# EAGLE design Beta24_mt (EAGLE 9.4.2)
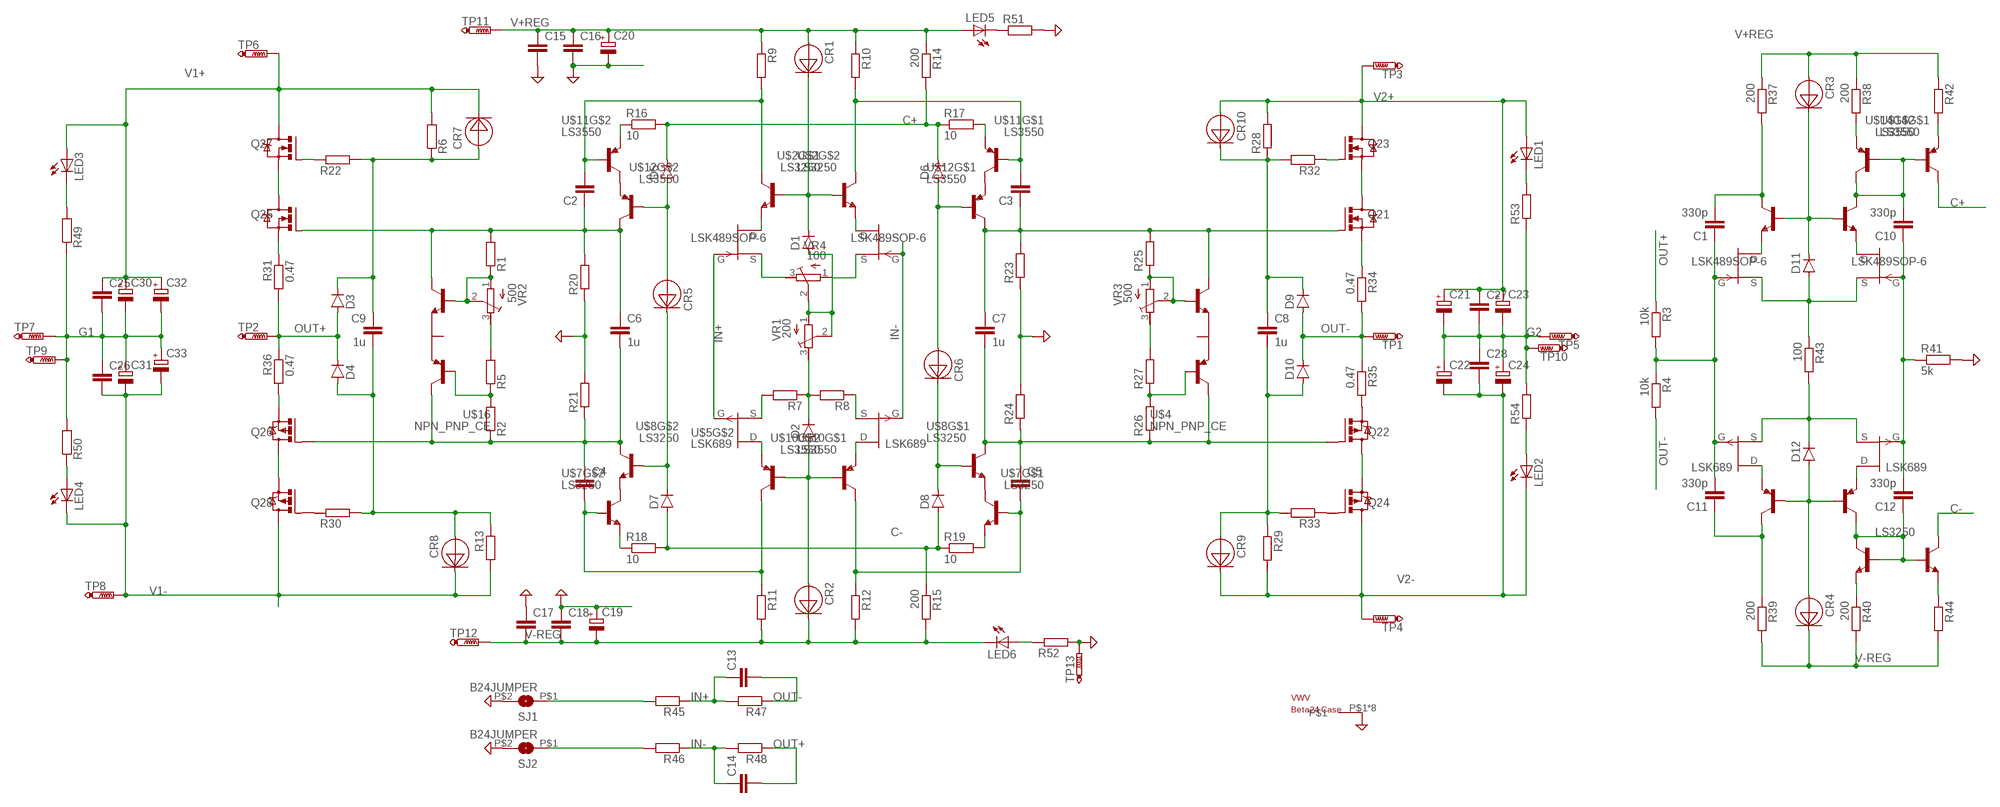
[diagram p0: schematic, sheet 1]

## Parts
C1  330p  C-EUC1206  [C1206]
C2  C-EUC1206  [C1206]
C3  C-EUC1206  [C1206]
C4  C-EUC1206  [C1206]
C5  C-EUC1206  [C1206]
C6  1u  C-EUC1210  [C1210]
C7  1u  C-EUC1210  [C1210]
C8  1u  C-EUC1206  [C1206]
C9  1u  C-EUC1206  [C1206]
C10  330p  C-EUC1206  [C1206]
C11  330p  C-EUC1206  [C1206]
C12  330p  C-EUC1206  [C1206]
C13  C-EUC1206  [C1206]
C14  C-EUC1206  [C1206]
C15  C-EUC1206  [C1206]
C16  C-EUC1206  [C1206]
C17  C-EUC1206  [C1206]
C18  C-EUC1206  [C1206]
C19  CPOL-EUG  [PANASONIC_G]
C20  CPOL-EUG  [PANASONIC_G]
C21  CPOL-EUG  [PANASONIC_G]
C22  CPOL-EUG  [PANASONIC_G]
C23  CPOL-EUG  [PANASONIC_G]
C24  CPOL-EUG  [PANASONIC_G]
C25  C-EUC1206  [C1206]
C26  C-EUC1206  [C1206]
C27  C-EUC1206  [C1206]
C28  C-EUC1206  [C1206]
C30  CPOL-EUG  [PANASONIC_G]
C31  CPOL-EUG  [PANASONIC_G]
C32  CPOL-EUG  [PANASONIC_G]
C33  CPOL-EUG  [PANASONIC_G]
CR1  1N5283  [SMD]
CR2  1N5283  [SMD]
CR3  1N5283  [SMD]
CR4  1N5283  [SMD]
CR5  1N5283  [SMD]
CR6  1N5283  [SMD]
CR7  1N5283  [SMD]
CR8  1N5283  [SMD]
CR9  1N5283  [SMD]
CR10  1N5283  [SMD]
D1  DIODE-SOD80C  [SOD80C]
D2  DIODE-SOD80C  [SOD80C]
D3  DIODE-SOD80C  [SOD80C]
D4  DIODE-SOD80C  [SOD80C]
D5  DIODE-SOD80C  [SOD80C]
D6  DIODE-SOD80C  [SOD80C]
D7  DIODE-SOD80C  [SOD80C]
D8  DIODE-SOD80C  [SOD80C]
D9  DIODE-SOD80C  [SOD80C]
D10  DIODE-SOD80C  [SOD80C]
D11  DIODE-SOD80C  [SOD80C]
D12  DIODE-SOD80C  [SOD80C]
LED1  LED_LEDSML1206  [LED_SML1206]
LED2  LED_LEDSML1206  [LED_SML1206]
LED3  LED_LEDSML1206  [LED_SML1206]
LED4  LED_LEDSML1206  [LED_SML1206]
LED5  LED_LEDSML1206  [LED_SML1206]
LED6  LED_LEDSML1206  [LED_SML1206]
Q21  IRFZ24ND2PAK  [TO254P1054X240-3M]
Q22  IRF9Z34D2PAK  [TO254P1054X240-3M]
Q23  IRFZ24ND2PAK  [TO254P1054X240-3M]
Q24  IRF9Z34D2PAK  [TO254P1054X240-3M]
Q25  IRFZ24ND2PAK  [TO254P1054X240-3M]
Q26  IRF9Z34D2PAK  [TO254P1054X240-3M]
Q27  IRFZ24ND2PAK  [TO254P1054X240-3M]
Q28  IRF9Z34D2PAK  [TO254P1054X240-3M]
R1  R-EU_MELF0204W  [MINI_MELF-0204W]
R2  R-EU_MELF0204W  [MINI_MELF-0204W]
R3  10k  R-EU_MELF0204W  [MINI_MELF-0204W]
R4  10k  R-EU_MELF0204W  [MINI_MELF-0204W]
R5  R-EU_MELF0204W  [MINI_MELF-0204W]
R6  R-EU_MELF0204W  [MINI_MELF-0204W]
R7  R-EU_MELF0204W  [MINI_MELF-0204W]
R8  R-EU_MELF0204W  [MINI_MELF-0204W]
R9  R-EU_MELF0204W  [MINI_MELF-0204W]
R10  R-EU_MELF0204W  [MINI_MELF-0204W]
R11  R-EU_MELF0204W  [MINI_MELF-0204W]
R12  R-EU_MELF0204W  [MINI_MELF-0204W]
R13  R-EU_MELF0204W  [MINI_MELF-0204W]
R14  200  R-EU_MELF0204W  [MINI_MELF-0204W]
R15  200  R-EU_MELF0204W  [MINI_MELF-0204W]
R16  10  R-EU_MELF0204W  [MINI_MELF-0204W]
R17  10  R-EU_MELF0204W  [MINI_MELF-0204W]
R18  10  R-EU_MELF0204W  [MINI_MELF-0204W]
R19  10  R-EU_MELF0204W  [MINI_MELF-0204W]
R20  R-EU_MELF0204W  [MINI_MELF-0204W]
R21  R-EU_MELF0204W  [MINI_MELF-0204W]
R22  R-EU_MELF0204W  [MINI_MELF-0204W]
R23  R-EU_MELF0204W  [MINI_MELF-0204W]
R24  R-EU_MELF0204W  [MINI_MELF-0204W]
R25  R-EU_MELF0204W  [MINI_MELF-0204W]
R26  R-EU_MELF0204W  [MINI_MELF-0204W]
R27  R-EU_MELF0204W  [MINI_MELF-0204W]
R28  R-EU_MELF0204W  [MINI_MELF-0204W]
R29  R-EU_MELF0204W  [MINI_MELF-0204W]
R30  R-EU_MELF0204W  [MINI_MELF-0204W]
R31  0.47  R-EU_R2512  [R2512]
R32  R-EU_MELF0204W  [MINI_MELF-0204W]
R33  R-EU_MELF0204W  [MINI_MELF-0204W]
R34  0.47  R-EU_R2512  [R2512]
R35  0.47  R-EU_R2512  [R2512]
R36  0.47  R-EU_R2512  [R2512]
R37  200  R-EU_MELF0204W  [MINI_MELF-0204W]
R38  200  R-EU_MELF0204W  [MINI_MELF-0204W]
R39  200  R-EU_MELF0204W  [MINI_MELF-0204W]
R40  200  R-EU_MELF0204W  [MINI_MELF-0204W]
R41  5k  R-EU_MELF0204W  [MINI_MELF-0204W]
R42  R-EU_MELF0204W  [MINI_MELF-0204W]
R43  100  R-EU_MELF0204W  [MINI_MELF-0204W]
R44  R-EU_MELF0204W  [MINI_MELF-0204W]
R45  R-EU_MELF0204W  [MINI_MELF-0204W]
R46  R-EU_MELF0204W  [MINI_MELF-0204W]
R47  R-EU_MELF0204W  [MINI_MELF-0204W]
R48  R-EU_MELF0204W  [MINI_MELF-0204W]
R49  R-EU_MELF0204W  [MINI_MELF-0204W]
R50  R-EU_MELF0204W  [MINI_MELF-0204W]
R51  200  R-EU_MELF0204W  [MINI_MELF-0204W]
R52  R-EU_MELF0204W  [MINI_MELF-0204W]
R53  R-EU_MELF0204W  [MINI_MELF-0204W]
R54  R-EU_MELF0204W  [MINI_MELF-0204W]
SJ1  B24JUMPER  [B24J]
SJ2  B24JUMPER  [B24J]
TP1  PTR1PAD1-20  [P1-20]
TP2  PTR1PAD1-20  [P1-20]
TP3  PTR1PAD1-20  [P1-20]
TP4  PTR1PAD1-20  [P1-20]
TP5  PTR1PAD1-20  [P1-20]
TP6  PTR1PAD1-20  [P1-20]
TP7  PTR1PAD1-20  [P1-20]
TP8  PTR1PAD1-20  [P1-20]
TP9  PTR1PAD1-20  [P1-20]
TP10  PTR1PAD1-20  [P1-20]
TP11  PTR1PAD1-20  [P1-20]
TP12  PTR1PAD1-20  [P1-20]
TP13  PTR1PAD1-20  [P1-20]
U$1  LSK489SOP-6  [SOT-23-6]
U$2  LS3250  [SOT-23-6]
U$3  LSK489SOP-6  [SOT-23-6]
U$4  NPN_PNP_CE  [SOT25]
U$5  LSK689  [SOT-23-6]
U$6  LS3250  [SOT-23-6]
U$7  LS3250  [SOT-23-6]
U$8  LS3250  [SOT-23-6]
U$9  LS3550  [SOT-23-6]
U$10  LS3550  [SOT-23-6]
U$11  LS3550  [SOT-23-6]
U$12  LS3550  [SOT-23-6]
U$13  LS3250  [SOT-23-6]
U$14  LS3550  [SOT-23-6]
U$15  LSK689  [SOT-23-6]
U$16  NPN_PNP_CE  [SOT25]
U$17  VWV  [VWV]
U$18  B24C  [B24C]
VR1  200  R-TRIMM3296W  [RTRIM3296W]
VR2  500  R-TRIMM3296W  [RTRIM3296W]
VR3  500  R-TRIMM3296W  [RTRIM3296W]
VR4  100  R-TRIMM3296W  [RTRIM3296W]

## Nets
C+: D5.C D6.C R14.2 R16.2 R17.1 U$14.6(C)
C-: D7.A D8.A R15.1 R18.2 R19.1 U$13.6(C)
G1: C25.2 C26.1 C30.- C31.+ C32.- C33.+ R49.1 R50.2 TP7.TP TP9.TP
G2: C21.- C22.+ C23.- C24.+ C27.2 C28.1 R53.1 R54.2 TP5.TP TP10.TP
GND: C15.2 C16.2 C17.1 C18.1 C19.+ C20.- R20.1 R21.2 R23.1 R24.2 R41.2 R51.2 R52.2 SJ1.P$2 SJ2.P$2 TP13.TP U$18.P$1 U$18.P$2 U$18.P$3 U$18.P$4 U$18.P$5 U$18.P$6 U$18.P$7 U$18.P$8
IN+: C13.1 R45.1 R47.2 U$1.1(G) U$5.4(G)
IN-: C14.1 R46.1 R48.2 U$1.4(G) U$5.1(G)
N$1: C12.1 U$9.6(C) U$13.1(B) U$13.3(B) U$13.4(C)
N$2: U$1.5(D) U$2.2(E)
N$3: U$1.3(S) VR4.3(E)
N$4: R7.2 U$5.6(S)
N$5: U$1.2(D) U$2.5(E)
N$6: U$5.5(D) U$10.2(E)
N$7: U$1.6(S) VR4.1(A)
N$8: D2.C R7.1 R8.2 VR1.3(E)
N$9: R8.1 U$5.3(S)
N$10: U$5.2(D) U$10.5(E)
N$11: D1.A VR1.1(A) VR1.2(S) VR4.2(S)
N$12: CR2.ANODE D2.A U$10.1(B) U$10.3(B)
N$13: C2.2 R9.2 U$2.6(C) U$11.3(B)
N$14: C3.2 R10.2 U$2.4(C) U$11.1(B)
N$15: C3.1 C7.1 Q21.1(G) R23.2 R25.2 U$4.5(C1) U$12.6(C)
N$16: CR1.CATHODE D1.C U$2.1(B) U$2.3(B)
N$17: R40.1 U$13.2(E)
N$18: C5.2 R12.1 U$7.1(B) U$10.6(C)
N$19: C1.1 C11.2 R3.2 R4.1 U$3.1(G) U$15.4(G)
N$20: C8.2 CR9.ANODE D10.A R29.1 R33.2
N$21: D12.C R43.2 U$15.3(S) U$15.6(S)
N$22: D11.A R43.1 U$3.3(S) U$3.6(S)
N$23: U$11.6(C) U$12.5(E)
N$24: C4.2 R11.1 U$7.3(B) U$10.4(C)
N$25: U$11.4(C) U$12.2(E)
N$26: R38.2 U$14.2(E)
N$27: R16.1 U$11.2(E)
N$28: R17.2 U$11.5(E)
N$29: C10.2 U$6.4(C) U$14.1(B) U$14.3(B) U$14.4(C)
N$30: R18.1 U$7.2(E)
N$31: R19.2 U$7.5(E)
N$32: R45.2 SJ1.P$1
N$33: U$3.5(D) U$6.2(E)
N$34: CR4.ANODE D12.A U$9.1(B) U$9.3(B)
N$35: C2.1 C6.1 Q25.1(G) R1.2 R20.2 U$12.4(C) U$16.5(C1)
N$36: C4.1 C6.2 Q26.1(G) R2.1 R21.1 U$8.4(C) U$16.4(C2)
N$37: U$7.6(C) U$8.5(E)
N$38: U$7.4(C) U$8.2(E)
N$39: R25.1 U$4.1(B1) VR3.1(A) VR3.2(S)
N$42: C1.2 R37.2 U$6.6(C)
N$43: CR5.ANODE D5.A U$12.3(B)
N$44: CR6.ANODE D6.A U$12.1(B)
N$45: CR5.CATHODE D7.C U$8.3(B)
N$46: CR6.CATHODE D8.C U$8.1(B)
N$47: R26.2 R27.1 U$4.3(B2)
N$48: R27.2 VR3.3(E)
N$50: C5.1 C7.2 Q22.1(G) R24.1 R26.1 U$4.4(C2) U$8.6(C)
N$51: R2.2 R5.1 U$16.3(B2)
N$53: R44.1 U$13.5(E)
N$54: C8.1 CR10.CATHODE D9.C R28.1 R32.2
N$57: Q21.2(D) Q21.4(D) Q21.P$1(D) Q21.P$2(D) Q21.P$3(D) Q21.P$4(D) Q21.P$5(D) Q21.P$6(D) Q21.P$7(D) Q21.P$8(D) Q21.P$9(D) Q21.P$10(D) Q21.P$11(D) Q21.P$12(D) Q21.P$13(D) Q21.P$14(D) Q21.P$15(D) Q21.P$16(D) Q21.P$17(D) Q21.P$18(D) Q21.P$19(D) Q21.P$20(D) Q21.P$21(D) Q21.P$22(D) Q21.P$23(D) Q21.P$24(D) Q21.P$25(D) Q21.P$26(D) Q21.P$27(D) Q21.P$28(D) Q21.P$29(D) Q21.P$30(D) Q21.P$31(D) Q21.P$32(D) Q21.P$33(D) Q21.P$34(D) Q21.P$35(D) Q21.P$36(D) Q21.P$37(D) Q21.P$38(D) Q21.P$39(D) Q21.P$40(D) Q21.P$41(D) Q21.P$42(D) Q21.P$43(D) Q21.P$44(D) Q21.P$45(D) Q21.P$46(D) Q21.P$47(D) Q21.P$48(D) Q21.P$49(D) Q21.P$50(D) Q21.P$51(D) Q21.P$52(D) Q21.P$53(D) Q21.P$54(D) Q21.P$55(D) Q21.P$56(D) Q21.P$57(D) Q21.P$58(D) Q21.P$59(D) Q21.P$60(D) Q21.P$61(D) Q21.P$62(D) Q21.P$63(D) Q23.3(S)
N$58: Q22.2(D) Q22.4(D) Q22.P$1(D) Q22.P$2(D) Q22.P$3(D) Q22.P$4(D) Q22.P$5(D) Q22.P$6(D) Q22.P$7(D) Q22.P$8(D) Q22.P$9(D) Q22.P$10(D) Q22.P$11(D) Q22.P$12(D) Q22.P$13(D) Q22.P$14(D) Q22.P$15(D) Q22.P$16(D) Q22.P$17(D) Q22.P$18(D) Q22.P$19(D) Q22.P$20(D) Q22.P$21(D) Q22.P$22(D) Q22.P$23(D) Q22.P$24(D) Q22.P$25(D) Q22.P$26(D) Q22.P$27(D) Q22.P$28(D) Q22.P$29(D) Q22.P$30(D) Q22.P$31(D) Q22.P$32(D) Q22.P$33(D) Q22.P$34(D) Q22.P$35(D) Q22.P$36(D) Q22.P$37(D) Q22.P$38(D) Q22.P$39(D) Q22.P$40(D) Q22.P$41(D) Q22.P$42(D) Q22.P$43(D) Q22.P$44(D) Q22.P$45(D) Q22.P$46(D) Q22.P$47(D) Q22.P$48(D) Q22.P$49(D) Q22.P$50(D) Q22.P$51(D) Q22.P$52(D) Q22.P$53(D) Q22.P$54(D) Q22.P$55(D) Q22.P$56(D) Q22.P$57(D) Q22.P$58(D) Q22.P$59(D) Q22.P$60(D) Q22.P$61(D) Q22.P$62(D) Q22.P$63(D) Q24.3(S)
N$59: Q23.1(G) R32.1
N$60: Q24.1(G) R33.1
N$61: C9.1 CR7.ANODE D3.C R6.1 R22.2
N$62: Q21.3(S) R34.1
N$63: Q22.3(S) R35.2
N$64: C9.2 CR8.ANODE D4.A R13.1 R30.2
N$65: Q25.2(D) Q25.4(D) Q25.P$1(D) Q25.P$2(D) Q25.P$3(D) Q25.P$4(D) Q25.P$5(D) Q25.P$6(D) Q25.P$7(D) Q25.P$8(D) Q25.P$9(D) Q25.P$10(D) Q25.P$11(D) Q25.P$12(D) Q25.P$13(D) Q25.P$14(D) Q25.P$15(D) Q25.P$16(D) Q25.P$17(D) Q25.P$18(D) Q25.P$19(D) Q25.P$20(D) Q25.P$21(D) Q25.P$22(D) Q25.P$23(D) Q25.P$24(D) Q25.P$25(D) Q25.P$26(D) Q25.P$27(D) Q25.P$28(D) Q25.P$29(D) Q25.P$30(D) Q25.P$31(D) Q25.P$32(D) Q25.P$33(D) Q25.P$34(D) Q25.P$35(D) Q25.P$36(D) Q25.P$37(D) Q25.P$38(D) Q25.P$39(D) Q25.P$40(D) Q25.P$41(D) Q25.P$42(D) Q25.P$43(D) Q25.P$44(D) Q25.P$45(D) Q25.P$46(D) Q25.P$47(D) Q25.P$48(D) Q25.P$49(D) Q25.P$50(D) Q25.P$51(D) Q25.P$52(D) Q25.P$53(D) Q25.P$54(D) Q25.P$55(D) Q25.P$56(D) Q25.P$57(D) Q25.P$58(D) Q25.P$59(D) Q25.P$60(D) Q25.P$61(D) Q25.P$62(D) Q25.P$63(D) Q27.3(S)
N$66: Q26.2(D) Q26.4(D) Q26.P$1(D) Q26.P$2(D) Q26.P$3(D) Q26.P$4(D) Q26.P$5(D) Q26.P$6(D) Q26.P$7(D) Q26.P$8(D) Q26.P$9(D) Q26.P$10(D) Q26.P$11(D) Q26.P$12(D) Q26.P$13(D) Q26.P$14(D) Q26.P$15(D) Q26.P$16(D) Q26.P$17(D) Q26.P$18(D) Q26.P$19(D) Q26.P$20(D) Q26.P$21(D) Q26.P$22(D) Q26.P$23(D) Q26.P$24(D) Q26.P$25(D) Q26.P$26(D) Q26.P$27(D) Q26.P$28(D) Q26.P$29(D) Q26.P$30(D) Q26.P$31(D) Q26.P$32(D) Q26.P$33(D) Q26.P$34(D) Q26.P$35(D) Q26.P$36(D) Q26.P$37(D) Q26.P$38(D) Q26.P$39(D) Q26.P$40(D) Q26.P$41(D) Q26.P$42(D) Q26.P$43(D) Q26.P$44(D) Q26.P$45(D) Q26.P$46(D) Q26.P$47(D) Q26.P$48(D) Q26.P$49(D) Q26.P$50(D) Q26.P$51(D) Q26.P$52(D) Q26.P$53(D) Q26.P$54(D) Q26.P$55(D) Q26.P$56(D) Q26.P$57(D) Q26.P$58(D) Q26.P$59(D) Q26.P$60(D) Q26.P$61(D) Q26.P$62(D) Q26.P$63(D) Q28.3(S)
N$67: Q27.1(G) R22.1
N$68: Q28.1(G) R30.1
N$69: Q26.3(S) R36.2
N$70: Q25.3(S) R31.1
N$71: R1.1 U$16.1(B1) VR2.1(A) VR2.2(S)
N$72: R5.2 VR2.3(E)
N$73: CR3.CATHODE D11.C U$6.1(B) U$6.3(B)
N$75: U$3.2(D) U$6.5(E)
N$76: C10.1 C12.2 R41.1 U$3.4(G) U$15.1(G)
N$77: U$9.2(E) U$15.5(D)
N$79: U$9.5(E) U$15.2(D)
N$80: C11.1 R39.1 U$9.4(C)
N$81: R42.2 U$14.5(E)
N$82: R46.2 SJ2.P$1
N$89: LED3.C R49.2
N$90: LED4.A R50.1
N$91: LED5.C R51.1
N$92: LED6.A R52.1
N$93: LED2.A R54.1
N$94: LED1.C R53.2
OUT+: C14.2 D3.A D4.C R3.1 R31.2 R36.1 R48.1 TP2.TP
OUT-: C13.2 D9.A D10.C R4.2 R34.2 R35.1 R47.1 TP1.TP
V1+: C25.1 C30.+ C32.+ CR7.CATHODE LED3.A Q27.2(D) Q27.4(D) Q27.P$1(D) Q27.P$2(D) Q27.P$3(D) Q27.P$4(D) Q27.P$5(D) Q27.P$6(D) Q27.P$7(D) Q27.P$8(D) Q27.P$9(D) Q27.P$10(D) Q27.P$11(D) Q27.P$12(D) Q27.P$13(D) Q27.P$14(D) Q27.P$15(D) Q27.P$16(D) Q27.P$17(D) Q27.P$18(D) Q27.P$19(D) Q27.P$20(D) Q27.P$21(D) Q27.P$22(D) Q27.P$23(D) Q27.P$24(D) Q27.P$25(D) Q27.P$26(D) Q27.P$27(D) Q27.P$28(D) Q27.P$29(D) Q27.P$30(D) Q27.P$31(D) Q27.P$32(D) Q27.P$33(D) Q27.P$34(D) Q27.P$35(D) Q27.P$36(D) Q27.P$37(D) Q27.P$38(D) Q27.P$39(D) Q27.P$40(D) Q27.P$41(D) Q27.P$42(D) Q27.P$43(D) Q27.P$44(D) Q27.P$45(D) Q27.P$46(D) Q27.P$47(D) Q27.P$48(D) Q27.P$49(D) Q27.P$50(D) Q27.P$51(D) Q27.P$52(D) Q27.P$53(D) Q27.P$54(D) Q27.P$55(D) Q27.P$56(D) Q27.P$57(D) Q27.P$58(D) Q27.P$59(D) Q27.P$60(D) Q27.P$61(D) Q27.P$62(D) Q27.P$63(D) R6.2 TP6.TP
V1-: C26.2 C31.- C33.- CR8.CATHODE LED4.C Q28.2(D) Q28.4(D) Q28.P$1(D) Q28.P$2(D) Q28.P$3(D) Q28.P$4(D) Q28.P$5(D) Q28.P$6(D) Q28.P$7(D) Q28.P$8(D) Q28.P$9(D) Q28.P$10(D) Q28.P$11(D) Q28.P$12(D) Q28.P$13(D) Q28.P$14(D) Q28.P$15(D) Q28.P$16(D) Q28.P$17(D) Q28.P$18(D) Q28.P$19(D) Q28.P$20(D) Q28.P$21(D) Q28.P$22(D) Q28.P$23(D) Q28.P$24(D) Q28.P$25(D) Q28.P$26(D) Q28.P$27(D) Q28.P$28(D) Q28.P$29(D) Q28.P$30(D) Q28.P$31(D) Q28.P$32(D) Q28.P$33(D) Q28.P$34(D) Q28.P$35(D) Q28.P$36(D) Q28.P$37(D) Q28.P$38(D) Q28.P$39(D) Q28.P$40(D) Q28.P$41(D) Q28.P$42(D) Q28.P$43(D) Q28.P$44(D) Q28.P$45(D) Q28.P$46(D) Q28.P$47(D) Q28.P$48(D) Q28.P$49(D) Q28.P$50(D) Q28.P$51(D) Q28.P$52(D) Q28.P$53(D) Q28.P$54(D) Q28.P$55(D) Q28.P$56(D) Q28.P$57(D) Q28.P$58(D) Q28.P$59(D) Q28.P$60(D) Q28.P$61(D) Q28.P$62(D) Q28.P$63(D) R13.2 TP8.TP
V2+: C21.+ C23.+ C27.1 CR10.ANODE LED1.A Q23.2(D) Q23.4(D) Q23.P$1(D) Q23.P$2(D) Q23.P$3(D) Q23.P$4(D) Q23.P$5(D) Q23.P$6(D) Q23.P$7(D) Q23.P$8(D) Q23.P$9(D) Q23.P$10(D) Q23.P$11(D) Q23.P$12(D) Q23.P$13(D) Q23.P$14(D) Q23.P$15(D) Q23.P$16(D) Q23.P$17(D) Q23.P$18(D) Q23.P$19(D) Q23.P$20(D) Q23.P$21(D) Q23.P$22(D) Q23.P$23(D) Q23.P$24(D) Q23.P$25(D) Q23.P$26(D) Q23.P$27(D) Q23.P$28(D) Q23.P$29(D) Q23.P$30(D) Q23.P$31(D) Q23.P$32(D) Q23.P$33(D) Q23.P$34(D) Q23.P$35(D) Q23.P$36(D) Q23.P$37(D) Q23.P$38(D) Q23.P$39(D) Q23.P$40(D) Q23.P$41(D) Q23.P$42(D) Q23.P$43(D) Q23.P$44(D) Q23.P$45(D) Q23.P$46(D) Q23.P$47(D) Q23.P$48(D) Q23.P$49(D) Q23.P$50(D) Q23.P$51(D) Q23.P$52(D) Q23.P$53(D) Q23.P$54(D) Q23.P$55(D) Q23.P$56(D) Q23.P$57(D) Q23.P$58(D) Q23.P$59(D) Q23.P$60(D) Q23.P$61(D) Q23.P$62(D) Q23.P$63(D) R28.2 TP3.TP
V2-: C22.- C24.- C28.2 CR9.CATHODE LED2.C Q24.2(D) Q24.4(D) Q24.P$1(D) Q24.P$2(D) Q24.P$3(D) Q24.P$4(D) Q24.P$5(D) Q24.P$6(D) Q24.P$7(D) Q24.P$8(D) Q24.P$9(D) Q24.P$10(D) Q24.P$11(D) Q24.P$12(D) Q24.P$13(D) Q24.P$14(D) Q24.P$15(D) Q24.P$16(D) Q24.P$17(D) Q24.P$18(D) Q24.P$19(D) Q24.P$20(D) Q24.P$21(D) Q24.P$22(D) Q24.P$23(D) Q24.P$24(D) Q24.P$25(D) Q24.P$26(D) Q24.P$27(D) Q24.P$28(D) Q24.P$29(D) Q24.P$30(D) Q24.P$31(D) Q24.P$32(D) Q24.P$33(D) Q24.P$34(D) Q24.P$35(D) Q24.P$36(D) Q24.P$37(D) Q24.P$38(D) Q24.P$39(D) Q24.P$40(D) Q24.P$41(D) Q24.P$42(D) Q24.P$43(D) Q24.P$44(D) Q24.P$45(D) Q24.P$46(D) Q24.P$47(D) Q24.P$48(D) Q24.P$49(D) Q24.P$50(D) Q24.P$51(D) Q24.P$52(D) Q24.P$53(D) Q24.P$54(D) Q24.P$55(D) Q24.P$56(D) Q24.P$57(D) Q24.P$58(D) Q24.P$59(D) Q24.P$60(D) Q24.P$61(D) Q24.P$62(D) Q24.P$63(D) R29.2 TP4.TP
V+REG: C15.1 C16.1 C20.+ CR1.ANODE CR3.ANODE LED5.A R9.1 R10.1 R14.1 R37.1 R38.1 R42.1 TP11.TP
V-REG: C17.2 C18.2 C19.- CR2.CATHODE CR4.CATHODE LED6.C R11.2 R12.2 R15.2 R39.2 R40.2 R44.2 TP12.TP
Unconnected: U$4.2(E) U$16.2(E)

## Library data of the parts
C1-C18 C25-C28 = Vwvwbg:C-EU: CAPACITOR, European symbol
C19-C24 C30-C33 = Vwvwbg:CPOL-EU: POLARIZED CAPACITOR, European symbol
CR1-CR10 = crd:1N5283: 0.22 mA through 4.23 mA current regulating diode series
D1-D12 = Vwvwbg:DIODE-: DIODE
LED1-LED6 = KGGR_M:LED_LED: LED OSRAM: - CHIPLED LG R971, LG N971, LY N971, LG Q971, LY Q971, LO R971, LY R971 LH N974, LH R974 LS Q976, LO Q976, LY Q976 LO Q996 - Hyper CHIPLED LW Q18S LB Q993, LB Q99A, LB R99A - SideLED LS A670, LO A670, LY A670, LG A670, LP A670 LB A673, LV A673, LT A673, LW A673 LH A674 LY A675 LS A676, LA A676, LO A676, LY A676, LW A676 LS A679, LY A679, LG A679 - Hyper Micro SIDELED® LS Y876, LA Y876, LO Y876, LY Y876 LT Y87S - SmartLED LW L88C, LW L88S LB L89C, LB L89S, LG L890 LS L89K, LO L89K, LY L89K LS L896, LA L896, LO L896, LY L896 - TOPLED LS T670, LO T670, LY T670, LG T670, LP T670 LSG T670, LSP T670, LSY T670, LOP T670, LYG T670 LG T671, LOG T671, LSG T671 LB T673, LV T673, LT T673, LW T673 LH T674 LS T676, LA T676, LO T676, LY T676, LB T676, LH T676, LSB T676, LW T676 LB T67C, LV T67C, LT T67C, LS T67K, LO T67K, LY T67K, LW E67C LS E67B, LA E67B, LO E67B, LY E67B, LB E67C, LV E67C, LT E67C LW T67C LS T679, LY T679, LG T679 LS T770, LO T770, LY T770, LG T770, LP T770 LB T773, LV T773, LT T773, LW T773 LH T774 LS E675, LA E675, LY E675, LS T675 LS T776, LA T776, LO T776, LY T776, LB T776 LHGB T686 LT T68C, LB T68C - Hyper Mini TOPLED® LB M676 - Mini TOPLED Santana® LG M470 LS M47K, LO M47K, LY M47K Source: http://www.osram.convergy.de LUXEON: - LUMILED® LXK2-PW12-R00, LXK2-PW12-S00, LXK2-PW14-U00, LXK2-PW14-V00 LXK2-PM12-R00, LXK2-PM12-S00, LXK2-PM14-U00 LXK2-PE12-Q00, LXK2-PE12-R00, LXK2-PE12-S00, LXK2-PE14-T00, LXK2-PE14-U00 LXK2-PB12-K00, LXK2-PB12-L00, LXK2-PB12-M00, LXK2-PB14-N00, LXK2-PB14-P00, LXK2-PB14-Q00 LXK2-PR12-L00, LXK2-PR12-M00, LXK2-PR14-Q00, LXK2-PR14-R00 LXK2-PD12-Q00, LXK2-PD12-R00, LXK2-PD12-S00 LXK2-PH12-R00, LXK2-PH12-S00 LXK2-PL12-P00, LXK2-PL12-Q00, LXK2-PL12-R00 Source: www.luxeon.com KINGBRIGHT: KA-3528ASYC Source: www.kingbright.com
Q21 Q23 Q25 Q27 = Vwvwbg:IRFZ24N
Q22 Q24 Q26 Q28 = Vwvwbg:IRF9Z34
R1-R54 = Vwvwbg:R-EU_: RESISTOR, European symbol
SJ1 SJ2 = Vwvwbg:B24JUMPER
TP1-TP13 = testpad:PTR1: TEST PIN
U$1 U$3 = Vwvwbg:LSK489
U$2 U$6-U$8 U$13 = Vwvwbg:LS3250
U$4 U$16 = Vwvwbg:NPN_PNP_CE
U$5 U$15 = Vwvwbg:LSK689
U$9-U$12 U$14 = Vwvwbg:LS3550
U$17 = Vwvwbg:VWV
U$18 = Vwvwbg:B24C
VR1-VR4 = Vwvwbg:R-TRIMM: Trimm resistor; SPICEMODEL: X; SPICEPREFIXL: POT

## Board
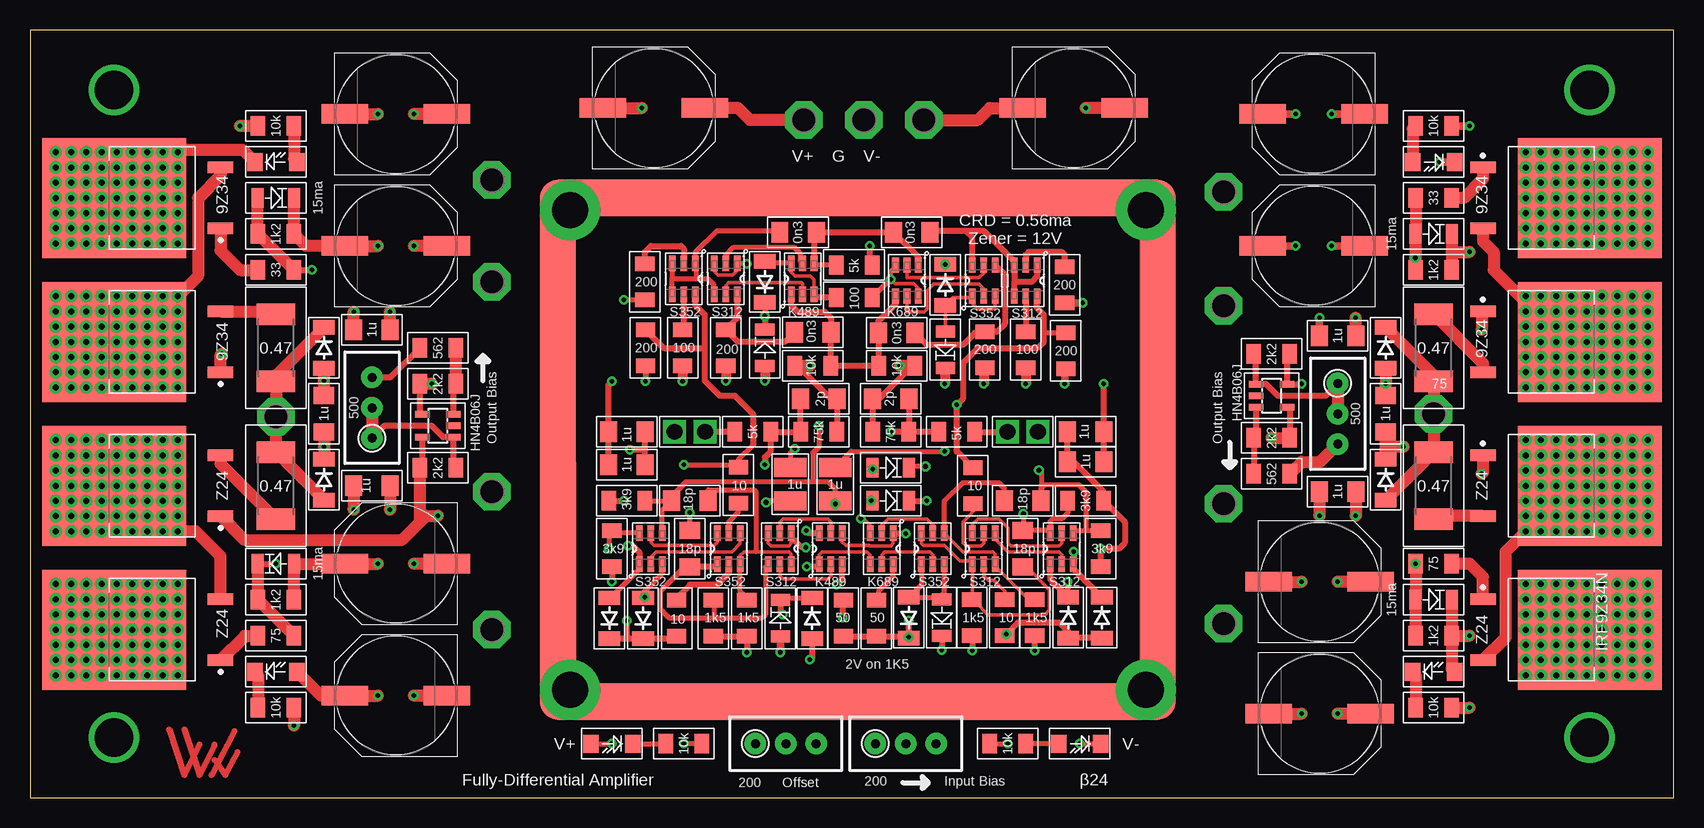
[diagram p1: board, top side]
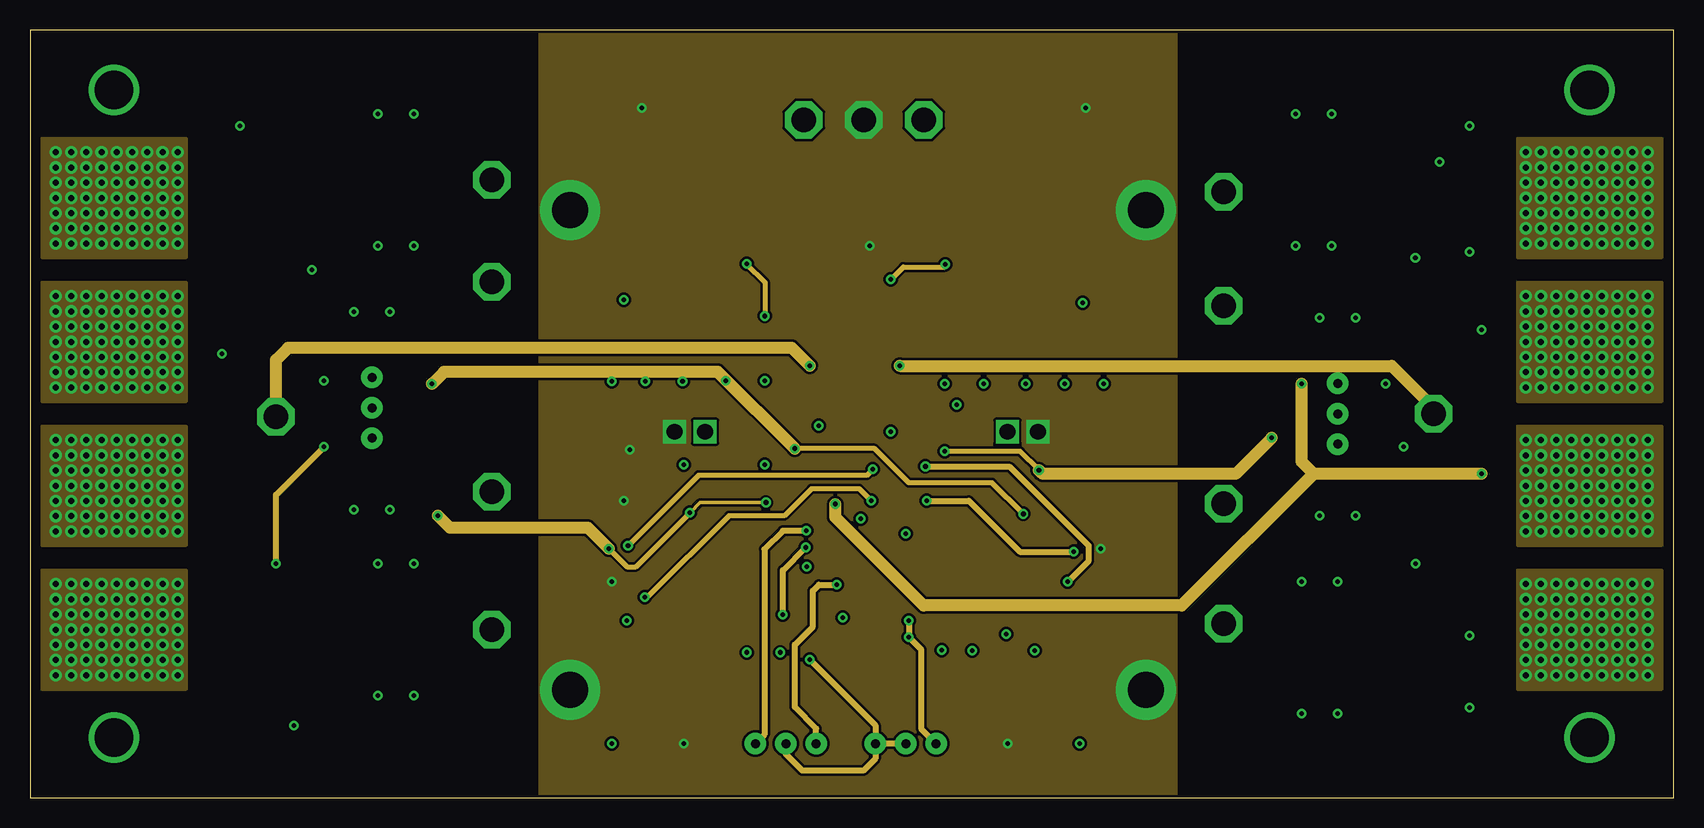
[diagram p2: board, inner layer Route2]
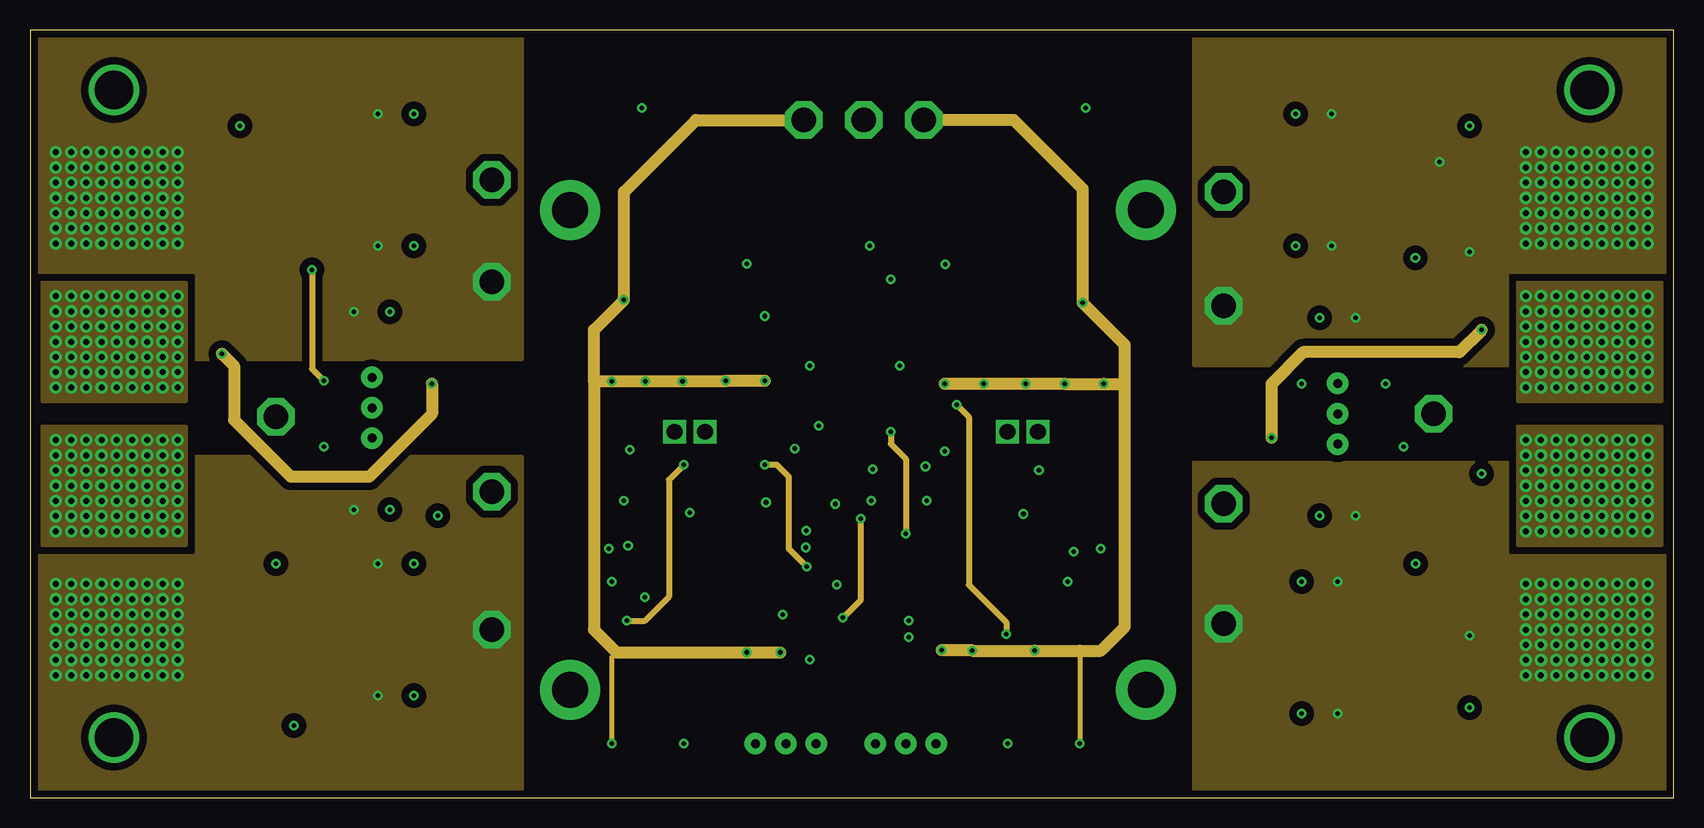
[diagram p3: board, inner layer Route15]
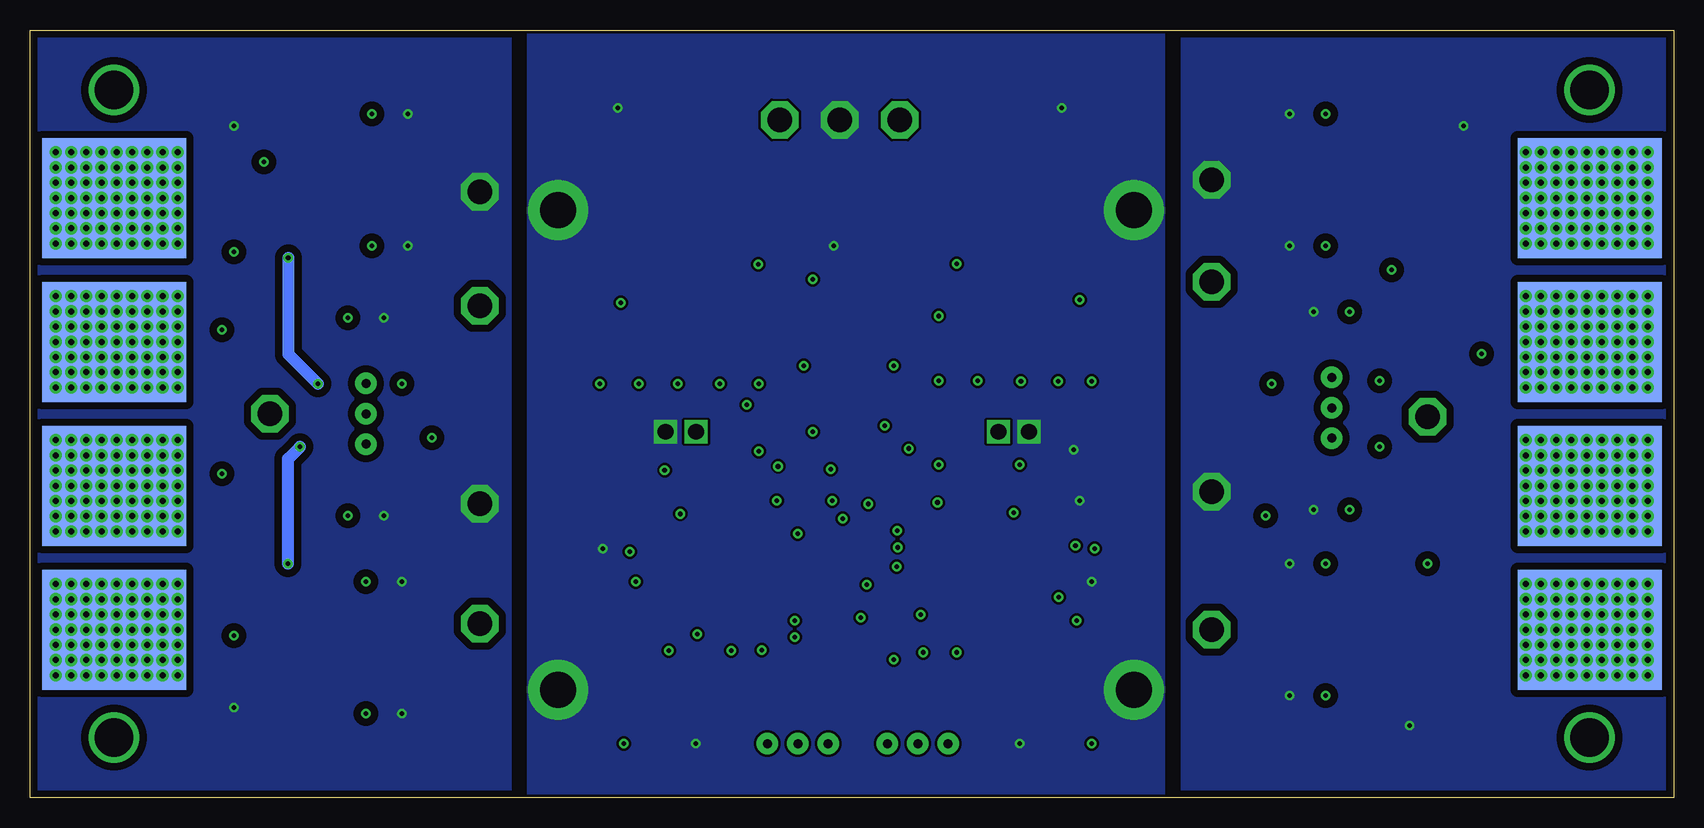
[diagram p4: board, bottom side, seen from below]

Size 137 x 64 mm. Coordinates in mm from the lower left corner, seen from the top.
Outline: 0,0 137,0 137,64 0,64 0,0
Copper layers (1+2*15+16): Top 0.035mm / dielectric 1.5mm / Route2 0.035mm / dielectric 0.15mm / Route15 0.035mm / dielectric 0.2mm / Bottom 0.035mm
Design rules "default *": minimum track width 10mil, minimum drill 0.4mm, track to track 8mil, track to pad 8mil, pad to pad 8mil, via to via 8mil, smd to smd 8mil, copper to edge 10mil, drill to drill 10mil, minimum pad ring 10mil, minimum via ring 8mil, stop-mask expansion 4mil, vias tented up to drill 0.4mm, thermal gap 15mil

### Footprints (pad centres in the part's own frame; a part is rotated, then mirrored left to right if it is on the bottom)
C1206 = smd 1.4 x 1.7: 1 -1.527,0; 2 1.527,0
C1210 = smd 1.6 x 2.7: 1 -1.4,0; 2 1.4,0
PANASONIC_G = smd 3.9 x 1.6: + 4.25,0; - -4.25,0
SMD = smd 1 x 1.6: ANODE 1.525,0; CATHODE -1.525,0
SOD80C = smd 1.2 x 1.8: A 1.7,0; C -1.7,0
LED_SML1206 = smd 1.3 x 1.5: A 1.75,0; C -1.75,0
TO254P1054X240-3M = smd 2.108 x 0.925: 1 -8.887,2.54; 3 -8.887,-2.54 | smd 12 x 10 bottom: 2 0,0 | smd 12 x 10: 4 0,0 | drill 0.5 pad 1.016: P$1 -4.045,2.54; P$2 -2.775,2.54; P$3 -1.505,2.54; P$4 -0.235,2.54; P$5 1.035,2.54; P$6 2.305,2.54; P$7 3.575,2.54; P$8 3.575,1.27; P$9 2.305,1.27; P$10 -0.235,1.27; P$11 1.035,1.27; P$12 -1.505,1.27; P$13 -2.775,1.27; P$14 -4.045,1.27; P$15 -4.045,0; P$16 -2.775,0; P$17 -1.505,0; P$18 -0.235,0; P$19 1.035,0; P$20 2.305,0; P$21 3.575,0; P$22 3.575,-1.27; P$23 2.305,-1.27; P$24 1.035,-1.27; P$25 -0.235,-1.27; P$26 -1.505,-1.27; P$27 -2.775,-1.27; P$28 -4.045,-1.27; P$29 -4.045,-2.54; P$30 -2.775,-2.54; P$31 -1.505,-2.54; P$32 -0.235,-2.54; P$33 1.035,-2.54; P$34 2.305,-2.54; P$35 3.575,-2.54; P$36 3.575,-3.81; P$37 2.305,-3.81; P$38 1.035,-3.81; P$39 -0.235,-3.81; P$40 -2.775,-3.81; P$41 -4.045,-3.81; P$42 -1.505,-3.81; P$43 -4.045,3.81; P$44 -2.775,3.81; P$45 -1.505,3.81; P$46 -0.235,3.81; P$47 1.035,3.81; P$48 2.305,3.81; P$49 3.575,3.81; P$50 4.845,3.81; P$51 4.845,2.54; P$52 4.845,1.27; P$53 4.845,0; P$54 4.845,-1.27; P$55 4.845,-2.54; P$56 4.845,-3.81; P$57 -5.315,3.81; P$58 -5.315,2.54; P$59 -5.315,1.27; P$60 -5.315,0; P$61 -5.315,-1.27; P$62 -5.315,-2.54; P$63 -5.315,-3.81
MINI_MELF-0204W = smd 1.2 x 1.6: 1 -1.5,0; 2 1.5,0
R2512 = smd 1.8 x 3.2: 1 -2.8,0; 2 2.8,0
B24J = drill 1.3 square: P$1 -1.27,0; P$2 1.27,0
P1-20 = drill 2.007 pad 3.15 octagon: TP 0,0
SOT-23-6 = smd 1.27 x 0.559: 1 -1.295,0.95; 2 -1.295,0; 3 -1.295,-0.95; 4 1.295,-0.95; 5 1.295,0; 6 1.295,0.95
SOT25 = smd 0.55 x 1.2: 1 -0.95,-1.3; 2 0,-1.3; 3 0.95,-1.3; 4 0.95,1.3; 5 -0.95,1.3
B24C = drill 3 pad 5: P$1 -24,20; P$2 24,20; P$3 24,-20; P$4 -24,-20 | smd 53 x 3: P$5 0,21; P$6 0,-21 | smd 3 x 45: P$7 -25,0; P$8 25,0
RTRIM3296W = drill 0.75 pad 1.778: 1 0,-2.54; 2 0,0; 3 0,2.54

### Placement (x,y rotation side)
C1  65.25,38.8 180 top
C2  55,24.75 0 top
C3  55,20.75 270 top
C4  82.75,24.75 180 top
C5  82.75,20.75 270 top
C6  67.12,26.12 90 top
C7  63.38,26.12 90 top
C8  24.5,32 90 top
C9  113,32 90 top
C10  64.03,47.12 180 top
C11  72.25,38.75 180 top
C12  73.5,47.12 180 top
C13  65.75,33.25 0 top
C14  71.75,33.25 180 top
C15  49.75,27.75 0 top
C16  49.75,30.5 0 top
C17  88,28 0 top
C18  88,30.5 0 top
C19  87,57.5 0 top
C20  52,57.5 0 top
C21  30.5,8.5 180 top
C22  30.5,57 0 top
C23  30.5,19.5 180 top
C24  30.5,46 0 top
C25  109,25.5 180 top
C26  109,38.5 0 top
C27  28.5,26 0 top
C28  28.5,39 180 top
C30  107.5,7 0 top
C31  107,46 180 top
C32  107.5,18 0 top
C33  107,57 180 top
CR1  62.55,14.95 270 top
CR2  76,15 90 top
CR3  61.25,37.5 270 top
CR4  76.3,37.35 90 top
CR5  71.75,24.75 180 top
CR6  71.75,27.5 180 top
CR7  117,16.5 180 top
CR8  117,47 180 top
CR9  20.5,50 180 top
CR10  20.5,19.5 0 top
D1  65.2,14.95 270 top
D2  73.25,15 90 top
D3  113,26.5 270 top
D4  113,37.5 270 top
D5  51.1,14.95 90 top
D6  48.3,14.95 90 top
D7  89.35,15 270 top
D8  86.55,15 270 top
D9  24.5,26.5 270 top
D10  24.5,37.5 270 top
D11  61.25,43 90 top
D12  76.3,42.75 270 top
LED1  20.5,10.5 0 top
LED2  20.5,53 0 top
LED3  117,10.5 0 top
LED4  117,53 180 top
LED5  48.5,4.5 180 top
LED6  87.5,4.5 180 top
Q21  7,26 180 top
Q22  7,38 180 top
Q23  7,14 180 top
Q24  7,50 180 top
Q25  130,26 0 top
Q26  130,38 0 top
Q27  130,14 0 top
Q28  130,50 0 top
R1  103.5,37 0 top
R2  103.5,30 180 top
R3  72.25,36 180 top
R4  65.25,36 180 top
R5  103.5,27 0 top
R6  117,13.5 0 top
R7  70.55,14.95 90 top
R8  67.8,14.95 270 top
R9  59.75,14.95 90 top
R10  56.95,14.95 90 top
R11  83.75,15 270 top
R12  78.5,15 270 top
R13  117,44 0 top
R14  51.3,37.5 90 top
R15  86.35,37.25 270 top
R16  53.9,14.95 270 top
R17  59.05,26.05 270 top
R18  81.25,15 270 top
R19  78.6,26 270 top
R20  49.75,24.75 0 top
R21  89.25,20.75 270 top
R22  117,19.5 180 top
R23  48.5,20.75 90 top
R24  88,24.75 0 top
R25  34,27.5 180 top
R26  34,34.5 0 top
R27  34,37.5 180 top
R28  20.5,16.5 0 top
R29  20.5,47 0 top
R30  117,50 180 top
R31  117,26 90 top
R32  20.5,13.5 0 top
R33  20.5,44 0 top
R34  20.5,26 90 top
R35  20.5,37.5 90 top
R36  117,37.5 90 top
R37  58,37.5 90 top
R38  51.25,43 90 top
R39  79.6,37.35 270 top
R40  86.25,42.75 270 top
R41  68.7,44.4 0 top
R42  54.4,37.5 90 top
R43  68.7,41.7 0 top
R44  83,37.35 270 top
R45  60.25,30.5 180 top
R46  77.25,30.5 0 top
R47  65.75,30.5 180 top
R48  71.75,30.5 0 top
R49  117,7.5 180 top
R50  117,56 0 top
R51  54.5,4.5 0 top
R52  81.5,4.5 180 top
R53  20.5,7.5 180 top
R54  20.5,56 180 top
SJ1  55,30.5 180 top
SJ2  82.75,30.5 0 top
TP1  20.5,31.75 0 top
TP2  117,32 0 top
TP3  38.5,14 0 top
TP4  38.5,43 0 top
TP5  38.5,25.5 0 top
TP6  99.5,14.5 0 top
TP7  99.5,24.5 0 top
TP8  99.5,41 0 top
TP9  99.5,50.5 0 top
TP10  38.5,51.5 0 top
TP11  64.5,56.5 0 top
TP12  74.5,56.5 0 top
TP13  69.5,56.5 0 top
U$1  66.75,20.75 90 top
U$2  62.5,20.75 270 top
U$3  64.4,43.25 90 top
U$4  34,31 90 top
U$5  71,20.75 270 top
U$6  58,43.25 270 top
U$7  79.5,20.75 90 top
U$8  86,20.75 90 top
U$9  79.5,43.1 90 top
U$10  75.25,20.75 90 top
U$11  58.25,20.75 90 top
U$12  51.75,20.75 90 top
U$13  83,43.1 270 top
U$14  54.5,43.25 270 top
U$15  73.1,43.1 270 top
U$16  103.5,33.5 270 top
U$17  14.12,1.88 0 top
U$18  69,29 0 top
VR1  73,4.5 270 top
VR2  109,32 180 top
VR3  28.5,32.5 0 top
VR4  63,4.5 270 top

### Tracks (layer width: path | path; a pad name or v marks a point on that pad's centre or on a via)
C+  (via drill 0.4)
  Top 0.406: 60.25,29.38 59.05,28.18 R17.1 58.85,27.75 v54.5,27.75
  Top 0.508: U$14.6 55.45,41.05 56.25,40.25 56.25,37.5 | R16.2 53.7,13.25 D5.C 50,13.25 | 50,13.25 D6.C | 60.25,29.38 60.25,32 58.75,33.5 57.5,33.5 56.25,34.75 56.25,37.5 | R14.2 52.8,37.5 56.25,37.5 | 50,13.25 49.75,13.5 v49.75,14.75
  Route15 0.508: v49.75,14.75 51.25,14.75 53.25,16.75 53.25,26.5 v54.5,27.75
C-  (via drill 0.4)
  Top 0.406: R15.1 84.5,38.75
  Top 0.508: D7.A D8.A 86.55,13.8 85.75,14.6 82.35,14.6 v81.38,13.62 R18.2 | R19.1 77.25,28.85 v77.25,32.75 77.75,33.25 77.75,36.25 79,37.5 84,37.5 84.5,38 84.5,38.75 84.5,40.25 83.95,40.8 U$13.6
  Route15 0.508: v77.25,32.75 78.25,31.75 78.25,17.75 81.38,14.62 v81.38,13.62
G1  (via drill 0.4)
  Top 0.61: C26.1 107.47,39.97 v107.5,40 | C31.+ v105.5,46 | C33.+ v105.5,57 | R50.2 v120,56
  Top 1.016: C32.- v106,18 | C25.2 107.47,23.53 v107.5,23.5 | R49.1 v120,7.5 | C30.- v106,7
  pour Bottom (isolate 0.61, rank 2, no thermals): 97,70 97,-4 140,-4 140,70
G2  (via drill 0.4)
  Top 1.016: C23.- v32,19.5 | C21.- v32,8.5 | C27.2 30.03,24.03 v30,24 | C28.1 30,39.03 v30,40.5 | C22.+ v32,57 | C24.+ v32,46 | R54.2 v17.5,56 | R53.1 v22,6
  pour Bottom (isolate 0.61, rank 2, no thermals): -4.5,71 41,71 41,-4 -4.5,-4
GND  (via drill 0.4)
  Top 0.406: R52.2 v81.5,4.5 | R51.2 v54.5,4.5
  Top 0.508: R23.1 v48.5,18 | R20.1 v49.5,24.75 | R21.2 v89.25,20.75 90.75,20.75 91.25,21.25 91.25,23 R24.2 89.5,25.5 87,28 C17.1 C18.1 | C15.2 51.28,29 | 51.28,29 C16.2 | 51.28,29 v50,29 | R41.2 70,44.6 v70,46
  Top 1.016: U$18.P$5 45.5,50 45,50.5 U$18.P$1 | C19.+ v88,57.5 | C20.- v51,57.5 | U$18.P$8 94,9.5 93,8.5 | 93,8.5 U$18.P$3 | U$18.P$7 45,28 U$18.P$4 | U$18.P$6 92.5,8 93,8.5
  pour Route2 (no thermals): 42.5,65.62 95.5,65.62 95.5,-3 42.5,-3
  pour Bottom (no thermals): 42.5,65.62 95.5,65.62 95.5,-3 42.5,-3
IN+  (via drill 0.4)
  Top 0.305: U$5.4 70,19.5 70,20.25 69.75,20.5 66,20.5 65.75,20.25 65.75,19.5 U$1.1
  Top 0.508: C13.1 64.22,30.53 R47.2 R45.1 61.75,28.88 61.25,28.38 v61.25,27.75 | U$1.1 65.59,19.25 v64.75,19.25
  Route15 0.508: v64.75,19.25 63.25,20.75 63.25,26.75 62.25,27.75 v61.25,27.75
IN-  (via drill 0.4)
  Top 0.305: U$5.1 71.95,21.2 71.75,21 69.97,21 69.96,21.01 68,21.01 67.7,21.31 U$1.4
  Top 0.508: C14.1 73.28,30.53 | 73.28,30.53 R48.2 | R46.1 73.3,30.5 | 73.3,30.5 73.28,30.53 | 73.3,30.5 v71.75,30.5 | v73,22 72,22 U$5.1
  Route15 0.508: v71.75,30.5 71.75,29.5 73,28.25 v73,22
N$1
  Top 0.508: U$13.4 82.05,43 | 78.03,47.25 79.5,47.25 82.05,44.7 U$13.3 82.05,43 | U$13.1 83.95,43.45 83.5,43 82.05,43 | U$9.6 78.55,46.73 78.03,47.25 | 78.03,47.25 75.15,47.25 C12.1
N$2
  Top 0.305: U$1.5 66.75,23 66.5,23.25 62.75,23.25 62.5,23 U$2.2
N$3  (via drill 0.4)
  Top 0.508: v67.25,17.75 67.7,18.2 U$1.3
  Route2 0.508: VR4.3 65.54,5.75 63.75,7.54 63.75,12.75 65.25,14.25 65.25,17.25 65.75,17.75 v67.25,17.75
N$4
  Top 0.406: R7.2 70.75,16.65 70.75,17.25 71.95,18.45 U$5.6
N$5
  Top 0.305: U$2.5 62.5,18.5 62.75,18.25 66.5,18.25 66.75,18.5 U$1.2
N$6
  Top 0.305: U$10.2 75.25,20.25 75,20.5 71.97,20.5 71.96,20.49 71.24,20.49 71,20.25 U$5.5
N$7  (via drill 0.4)
  Top 0.508: v64.7,22.25 64.91,22.05 U$1.6
  Route2 0.508: VR4.1 61.21,5.25 61.21,20.71 62.75,22.25 v64.7,22.25
N$8  (via drill 0.4)
  Top 0.508: R8.2 R7.1 73.1,13.45 D2.C v73.25,13.38 v73.25,14.75
  Route2 0.508: v73.25,14.75 v73.25,13.38 74.29,12.34 74.29,5.75 VR1.3
N$9  (via drill 0.4)
  Top 0.305: U$5.3 70.05,22.7 69.5,23.25 v69.25,23.25
  Top 0.508: v67.75,15 67.75,16.4 R8.1
  Route15 0.508: v67.75,15 69.25,16.5 v69.25,23.25
N$10
  Top 0.305: U$5.2 71,22.75 71.5,23.25 74.75,23.25 75.25,22.75 U$10.5
N$11  (via drill 0.4)
  Top 0.508: D1.A 65.2,11.7 v65,11.5
  Route2 0.508: v65,11.5 70.46,6.04 VR1.1 | VR1.2 VR1.1 | VR1.1 70.46,3.25 69.46,2.25 64.38,2.25 63,3.62 VR4.2
N$12
  Top 0.406: U$10.1 74.3,17.75 D2.A 75.83,16.7 | 75.83,16.7 CR2.ANODE | U$10.3 76.2,17.07 75.83,16.7
N$13
  Top 0.305: U$2.6 63.45,20.3 63.26,20.49 60.76,20.49 60.75,20.5 60.5,20.5 59.5,20.5 59.2,20.2 U$11.3
  Top 0.406: R9.2 59.75,16.65 59.2,17.2 U$11.3 | C2.2 56.53,25.65 60.35,25.65 60.5,25.5 60.5,20.5
N$14
  Top 0.406: C3.2 54.55,19.22 52.55,17.22 52.55,15.7 53.25,15 57,15 | U$2.4 61.3,19.2 61.3,15.25 61.05,15 57,15 | R10.2 57,16.4 57,15
  Top 0.508: U$11.1 57.07,19.22 C3.2
N$15  (via drill 0.4)
  Top 0.406: U$12.6 48.7,22.05 R23.2 48.25,22 v48.25,20.75 | C3.1 v55,23.75 | C7.1 61.48,24.73 v61.35,24.6
  Top 0.508: U$4.5 32.7,27.7 R25.2
  Top 1.016: Q21.1 17.85,21.5 31,21.5 32.5,23 | 32.5,23 R25.2 | 32.5,23 33,23.5 v34,23.5
  Route2 0.305: v61.35,24.6 55.85,24.6 v55,23.75
  Route2 0.406: v48.25,20.75 49.75,19.25 50.5,19.25 v55,23.75
  Route2 1.016: v34,23.5 35,22.5 46.5,22.5 v48.25,20.75
N$16  (via drill 0.4)
  Top 0.305: U$2.1 63.45,21.75 63.45,21.2 63.25,21 61.75,21 61.5,21.25 61.5,22 U$2.3
  Top 0.406: CR1.CATHODE 62.73,16.65 D1.C
  Top 0.508: v62.75,15.25 62.55,15.45 CR1.CATHODE | v64.66,20.86 64.34,20.86 63.45,21.75
  Route2 0.508: v62.75,15.25 62.75,18.95 v64.66,20.86
N$17
  Top 0.508: R40.1 86.25,45.25 86,45.5 83.25,45.5 83,45.25 U$13.2
N$18
  Top 0.305: U$10.6 74.3,21.2 74.49,21.01 76.24,21.01 77.5,19.75 78.25,19.75 U$7.1 78.55,16.8 78.4,16.65 78.4,16.4 R12.1 78.7,16.3 78.8,16.3 79.85,15.25 84.6,15.25 84.99,15.64 84.99,17.33 83.1,19.22 C5.2
N$19
  Top 0.508: U$3.1 63.45,41.05 64,40.5 66.25,40.5 66.78,39.97 C1.1 66.75,38.77 R4.1 R3.2 70.72,36.03 C11.2 70.72,39.72 72.15,41.15 U$15.4
N$20  (via drill 0.4)
  Top 0.508: R33.2 v23.5,44
  Top 1.016: CR9.ANODE 18.98,47.02 R29.1 R33.2 | C8.2 v24.5,34.75 D10.A
  Route15 0.508: v23.5,44 23.5,35.75 v24.5,34.75
N$21  (via drill 0.4)
  Top 0.305: U$15.3 71.75,43.99 v71.75,43.2 72.1,42.85 73.65,42.85 74.05,42.45 U$15.6
  Top 0.406: R43.2 71.7,43.2 v71.75,43.2
  Route2 0.406: v71.75,43.2 72.8,44.25 76.25,44.25 76.3,44.3 D12.C
  other vias: 76.3,44.45
N$22
  Top 0.305: U$3.3 65.35,43.2 65.05,43.5 63.75,43.5 63.45,43.8 U$3.6
  Top 0.406: U$3.6 61.41,44.55 D11.A
  Top 0.508: R43.1 65.61,41.7 U$3.3
N$23
  Top 0.305: U$11.6 57.3,21.3 57.01,21.01 52,21.01 51.75,21.26 U$12.5
N$24
  Top 0.305: R11.1 83.25,16.5 80.45,19.3 U$7.3 80.45,20.3 80.25,20.5 79.47,20.5 79.46,20.49 77.76,20.49 U$10.4
  Top 0.406: C4.2 81.22,25.78 80.75,26.25 77.75,26.25 76.2,24.7 U$10.4
N$25
  Top 0.305: U$11.4 59.2,21.2 58.5,20.5 52.2,20.5 51.75,20.05 U$12.2
N$26
  Top 0.508: R38.2 51.25,45.5 51.75,46 54.25,46 54.5,45.75 U$14.2
N$27
  Top 0.508: U$11.2 58.25,18.75 57.25,17.75 55,17.75 53.9,16.65 R16.1
N$28
  Top 0.406: U$11.5 58.25,23 59.05,23.8 R17.2
N$29
  Top 0.406: C10.2 62.37,47.25 57.25,47.25 55.45,45.45 U$14.1 55.5,44.49 55.5,43.25 | U$6.4 57,42.01 57,42.75 56.5,43.25 55.5,43.25 | 53.5,43.25 53.5,44.59 U$14.3 | 55.5,43.25 53.5,43.25 | U$14.4 53.5,42.01 53.5,43.25
N$30
  Top 0.305: U$7.2 79.5,18.5 79.9,18.1 80.35,18.1 81.25,17.2 R18.1
N$31
  Top 0.305: R19.2 79.14,24.39 77.75,23 77.75,21.25 78,21 79.25,21 79.5,21.25 U$7.5
N$32
  Top 0.508: R45.2 SJ1.P$1
N$33
  Top 0.406: U$3.5 64.24,44.71 64.24,45.35 63.74,45.84 58.59,45.84 58,45.25 U$6.2
N$34
  Top 0.305: CR4.ANODE D12.A 76.95,41.7 78.5,41.7 | U$9.1 78.5,41.8 78.5,41.7 | U$9.3 80.45,40.95 80.21,40.71 79.07,40.71 79.04,40.75 79,40.75 78.5,41.25 78.5,41.7
N$35  (via drill 0.4)
  Top 0.406: C2.1 53.47,25.12 54.67,26.32 65.25,26.32 | R20.2 C2.1 | U$12.4 52.7,23.98 C2.1 | v67.12,24.48 67.12,25 67.12,25.75 66.56,26.32 65.25,26.32 | v65.75,31 65.75,29.25 65.25,28.75 65.25,26.32
  Top 0.508: R1.2 104.8,36.8 U$16.5 105.95,34.45 v106,34.5 | C6.1 67.12,25
  Top 1.016: Q25.1 121.11,27.11 v121,27
  Route2 1.016: v121,27 107,27 | 107,27 96.02,16.02 74.48,16.02 67.12,23.38 v67.12,24.48 | 107,27 106,28 v106,34.5
N$36  (via drill 0.4)
  Top 0.406: R21.1 88,22.25 | 88,22.25 87.16,22.25 U$8.4 | 88,22.25 88,25.5 87.4,26.1 84.6,26.1 84.28,25.78 C4.1 84.3,24.77 84.3,27.1 v84.1,27.3 | C6.2 68.47,28.88 v76.25,28.88
  Top 0.508: U$16.4 105,32.35 R2.1
  Top 1.016: Q26.1 121,40.43 v121,39 | v103.5,30 R2.1
  Route2 0.406: v84.1,27.3 82.53,28.88 v76.25,28.88
  Route2 1.016: v103.5,30 100.5,27 84.4,27 v84.1,27.3
  Route15 1.016: v103.5,30 103.5,34.5 106.14,37.14 119.14,37.14 v121,39
N$37
  Top 0.305: U$7.6 78.55,22.8 79,23.25 80.75,23.25 81.5,22.5 81.5,21.25 81.75,21 85.75,21 86,21.25 U$8.5
N$38
  Top 0.305: U$8.2 86,20.25 85.76,20.49 81.51,20.49 80.45,21.55 U$7.4
N$39
  Top 0.508: R25.1 35.3,27.7 U$4.1 34.45,30.05 33.5,31 33.12,31 33.1,30.98 29.52,30.98 VR3.1
  Top 1.016: VR3.2 VR3.1
N$40  (via drill 3.2)
  other vias: 130,5
N$41  (via drill 3.2)
  other vias: 7,5
N$42
  Top 0.508: U$6.6 58.95,39.95 R37.2 59,38 62.92,38 C1.2
N$43  (via drill 0.4)
  Top 0.406: CR5.ANODE v70.12,24.75 | D5.A 51.19,16.65 v51.25,16.71 51.25,17.25 52.7,18.7 U$12.3
  Route2 0.406: v70.12,24.75 69.12,25.75 65.12,25.75 62.88,23.5 58.25,23.5 51.46,16.71 v51.25,16.71
N$44  (via drill 0.4)
  Top 0.406: D6.A 48.4,16.65 50.8,19.05 U$12.1 50.8,19.5 | v70.25,27.38 70.22,27.4 CR6.ANODE
  Top 0.508: v49.85,21 50.25,21 50.8,20.45 50.8,19.5
  Route2 0.406: v49.85,21 55.73,26.88 69.75,26.88 v70.25,27.38
N$45  (via drill 0.4)
  Top 0.508: D7.C 86.95,19.1 U$8.3 87,19.5 v87,20.5 | CR5.CATHODE v74.75,24.75
  Route2 0.508: v74.75,24.75 78.25,24.75 82.5,20.5 v87,20.5
N$46  (via drill 0.4)
  Top 0.406: v74.64,27.61 73.39,27.61 CR6.CATHODE
  Top 0.508: U$8.1 85.05,18.2 D8.C 86.5,16.75 v86.5,18
  Route2 0.406: 74.69,27.56 v74.64,27.61
  Route2 0.508: v86.5,18 88.25,19.75 88.25,21 81.69,27.56 74.69,27.56
N$47
  Top 0.508: U$4.3 35.3,34.3 R26.2
  Top 1.016: R26.2 R27.1
N$48
  Top 0.508: R27.2 30.04,35.04 VR3.3
N$50  (via drill 0.4)
  Top 0.406: R24.1 86.5,23.75 86,23.25 85.25,23.25 85.05,23.05 U$8.6 84.82,22.28 C5.1 82.8,22.33 v82.8,23.65 | C7.2 63.38,28.72 v63.75,29.09
  Top 0.508: U$4.4 32.5,32.15 R26.1
  Top 1.016: Q22.1 15.89,36.89 v16,37 | v33.5,34.5 R26.1
  Route2 0.406: v63.75,29.09 70.41,29.09 73.25,26.25 80.2,26.25 v82.8,23.65
  Route2 1.016: v63.75,29.09 57.34,35.5 34.5,35.5 v33.5,34.5
  Route15 1.016: v16,37 17,36 17,31.5 21.75,26.75 28.25,26.75 33.5,32 v33.5,34.5
N$51
  Top 0.508: U$16.3 102.2,30.2 R2.2 R5.1
N$53
  Top 0.508: U$13.5 R44.1
N$54  (via drill 0.4)
  Top 0.508: CR10.CATHODE v20.5,19.5
  Top 1.016: C8.1 v24.5,29.25 D9.C | CR10.CATHODE 19,19.48 R28.1 R32.2
  Route2 0.508: v20.5,19.5 20.5,25.25 v24.5,29.25
N$57
  Top 0.508: Q21.2 10.81,22.19 13.81,22.19
  Top 1.016: Q23.3 15.89,20.11 13.81,22.19 Q21.P$57
  Bottom 0.508: Q21.2 10.81,22.19 Q21.P$57
  Bottom 1.016: Q21.2 Q21.P$18 | Q21.P$17 9,26.5 7.5,26.5 Q21.2 | Q21.2 7,27.04 Q21.P$25 | Q21.2 8.27,27.27 Q21.P$26 | Q21.2 Q21.P$19
  pour Route2 (no thermals): 1,31 13,31 13,21 1,21
  pour Route15 (no thermals): 1,31 13,31 13,21 1,21
N$58
  Top 0.508: Q22.4 11.5,42.5 13,42.5
  Top 1.016: Q24.3 15.89,51.89 14,50 14,43.49 13,42.5 Q22.P$63
  Bottom 0.508: Q22.4 10.81,41.81 Q22.P$63
  pour Route15 (no thermals): 1,43 13,43 13,33 1,33
  pour Route2 (no thermals): 1,43 13,43 13,33 1,33
N$59
  Top 1.016: Q23.1 17.93,13.5 R32.1
N$60
  Top 1.016: Q24.1 15.89,45.61 17.5,44 R33.1
N$61  (via drill 0.4)
  Top 1.016: R6.1 115.47,13.53 CR7.ANODE 115.5,16.52 R22.2 | D3.C 113,29.5 | 113,29.5 C9.1 | v114.5,29.25 113.25,29.25 113,29.5
  Bottom 1.016: R22.2 115.5,28.25 v114.5,29.25
  other vias: 115.5,19.5
N$62
  Top 1.016: Q21.3 15.89,27.81 R34.1
N$63
  Top 1.016: Q22.3 20.26,40.54 R35.2
N$64  (via drill 0.4)
  Top 1.016: R13.1 115.47,44.02 v115.47,45 CR8.ANODE 115.5,47.02 R30.2 | D4.A v113,34.5 C9.2
  Bottom 1.016: v115.47,45 115.47,36.98 v113,34.5
N$65
  Top 0.508: Q25.2 128.73,27.27 Q25.P$14
  Top 1.016: Q27.3 123,13.35 123,20.5 Q25.P$63
  Bottom 0.508: Q25.2 Q25.P$17 Q25.P$13
  pour Route2 (no thermals): 124,31 136,31 136,21 124,21
  pour Route15 (no thermals): 124,31 136,31 136,21 124,21
N$66
  Top 0.508: Q26.4 128,40 127.5,40 128.04,40.54 Q26.P$3
  Top 1.016: Q28.3 121.11,46.39 122,45.5 122,44 124.19,41.81 Q26.P$57
  Bottom 0.508: Q26.4 127.46,40.54 Q26.P$2
  pour Route2 (no thermals): 124,43 136,43 136,33 124,33
  pour Route15 (no thermals): 124,43 136,43 136,33 124,33
N$67
  Top 1.016: Q27.1 121.11,18.39 120,19.5 R22.1
N$68
  Top 1.016: Q28.1 121.11,51.61 119.5,50 R30.1
N$69
  Top 1.016: R36.2 121.11,36.19 Q26.3
N$70
  Top 1.016: Q25.3 117.26,23.46 R31.1
N$71
  Top 0.508: VR2.1 107.96,33.5 104,33.5 103,34.5 102.25,34.5 U$16.1 102.2,36.8 R1.1
  Top 1.016: VR2.1 VR2.2
N$72
  Top 1.016: R5.2 106,28 107.54,28 VR2.3
N$73  (via drill 0.4)
  Top 0.305: U$6.1 58.95,43.95 58.55,43.55 57.35,43.55 57,43.9 57,44.49
  Top 0.406: U$6.1 59.7,44.55 v59.74,44.5 | U$6.3 57,44.49
  Top 0.508: D11.C v61.25,40.15 CR3.CATHODE
  Route2 0.406: v59.74,44.5 61.25,42.99 v61.25,40.15
N$75
  Top 0.305: U$3.2 64.4,42.85 64.31,42.94 63.98,42.94 63.98,42.95 58.24,42.95 58,42.7 U$6.5
N$76
  Top 0.406: R41.1 65.5,44.4 U$3.4
  Top 0.508: U$3.4 65.35,46.92 C10.1 C12.2 74.05,45.05 U$15.1
N$77
  Top 0.305: U$15.5 73.1,40.5 74.5,40.5 74.75,40.75 74.75,42.25 75.3,42.8 79.1,42.8 79.5,42.4 U$9.2
N$79
  Top 0.305: U$9.5 79.5,43.75 79.11,43.36 73.1,43.36 U$15.2
N$80
  Top 0.508: U$9.4 81.25,43.59 81.25,39.5 80.6,38.85 R39.1 79.5,38.75 78.75,38.75 77.75,37.75 74.78,37.75 C11.1
N$81
  Top 0.406: R42.2 54.4,39.5 54.5,39.6
  Top 0.508: 54.5,39.6 U$14.5
N$82
  Top 0.508: R46.2 SJ2.P$1
N$87  (via drill 3.2)
  other vias: 7,59
N$88  (via drill 3.2)
  other vias: 130,59
N$89
  Top 1.016: LED3.C 115.5,10.25 R49.2
N$90
  Top 1.016: R50.1 115.25,55.75 LED4.A
N$91
  Top 0.406: LED5.C R51.1
N$92
  Top 0.406: LED6.A R52.1
N$93
  Top 1.016: R54.1 22,53.25 LED2.A
N$94
  Top 1.016: LED1.C 19,10.25 R53.2
OUT+  (via drill 0.4)
  Top 0.508: R48.1 70.25,33.22 C14.2 70.75,33.25 73.5,36 R3.1
  Top 1.016: R3.1 v72.5,36 | D3.A R31.2 TP2.TP R36.1 117,35.2 D4.C
  Route2 1.016: v72.5,36 113.5,36 117,32.5 TP2.TP
OUT-  (via drill 0.4)
  Top 0.508: R4.2 64,36 66.75,33.25 C13.2 67.25,33.22 R47.1
  Top 1.016: v65,36 R4.2 | D10.C 20.5,35.2 R35.1 TP1.TP R34.2 D9.A
  Route2 1.016: TP1.TP 20.5,36.5 21.5,37.5 63.5,37.5 v65,36
V1+  (via drill 0.4)
  Top 0.508: Q27.2 Q27.P$17 Q27.P$1
  Top 1.016: CR7.CATHODE 118.53,13.53 R6.2 | R6.2 118.5,10.75 LED3.A | C30.+ v109,7 | C32.+ v109,18 | C25.1 110.53,23.53 v110.5,23.5 | R6.2 v120,13.5
  Bottom 0.508: Q27.2 Q27.P$18 Q27.P$2
  pour Route2 (no thermals): 124,19 136,19 136,9 124,9
  pour Route15 (no thermals): 124,19 136,19 136,9 124,9
  pour Route15 (isolate 0.61, rank 2, no thermals): 97,28 138.5,28 138.5,-4 97,-4
V1-  (via drill 0.4)
  Top 0.508: Q28.4 129.76,50.23 Q28.P$10
  Top 0.61: C33.- v108.5,57 | C31.- v108.5,46 | LED4.C v117.5,53
  Top 1.016: CR8.CATHODE 118.5,46.98 118.5,45.5 | 118.5,45.5 R13.2 | 118.5,45.5 v120,45.5 | C26.2 110.5,38.53 v110.5,40
  Bottom 0.508: Q28.4 Q28.P$17 Q28.P$57
  pour Route2 (no thermals): 124,55 136,55 136,45 124,45
  pour Route15 (no thermals): 124,55 136,55 136,45 124,45
  pour Route15 (isolate 0.61, rank 2, no thermals): 97,65.5 138,65.5 138,36 97,36
V2+  (via drill 0.4)
  Top 0.508: C21.+ 25.5,8.5 | Q23.2 Q23.P$15
  Top 1.016: R28.2 22.02,16.52 CR10.ANODE C23.+ v29,19.5 | v29,8.5 25.5,8.5 24.25,8.5 LED1.A | C27.1 26.97,24.03 v27,24
  Bottom 0.508: Q23.2 10.81,17.81 Q23.P$41
  pour Route2 (no thermals): 1,19 13,19 13,9 1,9
  pour Route15 (no thermals): 1,19 13,19 13,9 1,9
  pour Route15 (isolate 0.61, rank 2, no thermals): 41,28.5 41,-2.5 -3.5,-2.5 -3.5,28.5
V2-  (via drill 0.4)
  Top 0.508: Q24.4 Q24.P$16
  Top 1.016: CR9.CATHODE 22,49.98 R29.2 23,46 C24.- v29,46 | C28.2 26.97,40.47 v27,40.5 | C22.- v29,57 | LED2.C 17.75,54 12.51,54 Q24.P$63
  Bottom 0.508: Q24.4 10.81,53.81 Q24.P$63
  pour Route2 (no thermals): 1,55 13,55 13,45 1,45
  pour Route15 (no thermals): 1,55 13,55 13,45 1,45
  pour Route15 (isolate 0.61, rank 2, no thermals): -1.5,66 41,66 41,36.5 -1.5,36.5
V+REG  (via drill 0.4)
  Top 0.406: R38.1 v49.5,41.5 | LED5.A v48.5,4.5
  Top 0.508: R14.1 v51.3,34.7 | R9.1 59.75,13.25 | 59.75,13.25 v59.75,12.1 | R10.1 59.55,13.45 59.75,13.25 | C15.1 C16.1 48.22,34.42 v48.5,34.7
  Top 0.61: CR1.ANODE v62.55,12.1
  Top 0.813: R42.1 v54.4,34.7 | R37.1 v58,34.75 | CR3.ANODE v61.25,34.75
  Top 1.016: TP11.TP 60,56.5 59,57.5 C20.+
  Route15 0.406: v48.5,4.5 48.5,11.7 48.9,12.1
  Route15 1.016: 47,34.7 47,14 48.9,12.1 v59.75,12.1 v62.55,12.1 | v61.25,34.75 v58,34.75 57.95,34.7 v54.4,34.7 v51.3,34.7 v48.5,34.7 47,34.7 | 47,34.7 47,39 v49.5,41.5 49.5,50.5 55.5,56.5 TP11.TP
V-REG  (via drill 0.4)
  Top 0.406: v87.5,4.5 LED6.C
  Top 0.508: v83.75,12.25 R11.2 | R12.2 78.55,13.45 v78.55,12.25 | CR2.CATHODE v76,12.3 | C17.2 C18.2 89.53,34.47 v89.5,34.5
  Top 0.61: v86.25,34.5 86.25,35.65 R15.2 | R40.2 v87.75,41.25
  Top 0.813: CR4.CATHODE 76.25,35.77 v76.25,34.5 | R39.2 79.5,35.75 v79.5,34.5 | R44.2 v83,34.5
  Top 1.016: TP12.TP 79,56.5 80,57.5 C19.-
  Route15 0.406: 87.5,12.25 v87.5,4.5
  Route15 1.016: v76,12.3 78.5,12.3 v78.55,12.25 v83.75,12.25 87.5,12.25 89.25,12.25 91.25,14.25 91.25,34.5 | 91.25,34.5 v89.5,34.5 v86.25,34.5 v83,34.5 v79.5,34.5 v76.25,34.5 | 91.25,34.5 91.25,37.75 v87.75,41.25 87.75,50.75 82,56.5 TP12.TP

### Text on the board
tPlace: 10k | 10k | V+ G V- | 9Z34 | 15ma | 33 | 9Z34 | 1k2 | 0n3 | 0n3 | CRD = 0.56ma / Zener = 12V | 15ma | 33 | 5k | 1k2 | 200 | 200 | 100 | S352 | S312 | K489 | K689 | S352 | S312 | 1u | 0n3 | 0n3 | 9Z34 | 0.47 | 562 | 200 | 100 | 1u | 0.47 | 9Z34 | 200 | 200 | 100 | 200 | 2k2 | 10k | 10k | 2k2 | HN4B06J | 75 | 2p | 2p | 1u | 500 | Output Bias | Output Bias | 500 | 1u | HN4B06J | 1u | 5k | 75k | 75k | 5k | 1u | 2k2 | 2k2 | 1u | 1u | 562 | Z24 | 0.47 | 1u | 10 | 1u | 1u | 10 | 1u | 0.47 | Z24 | 3k9 | 18p | 18p | 3k9 | 3k9 | 18p | 18p | 3k9 | 15ma | 75 | S352 | S352 | S312 | K489 | K689 | S352 | S312 | S312 | 1k2 | 15ma | IRF9Z34N | 10 | 1k5 | 1k5 | 50 | 50 | 1k5 | 10 | 1k5 | Z24 | 75 | 1k2 | Z24 | 2V on 1K5 | 10k | 10k | V+ | V- | 10k | 10k | Fully-Differential Amplifier | 200 | Offset | 200 | Input Bias | β24